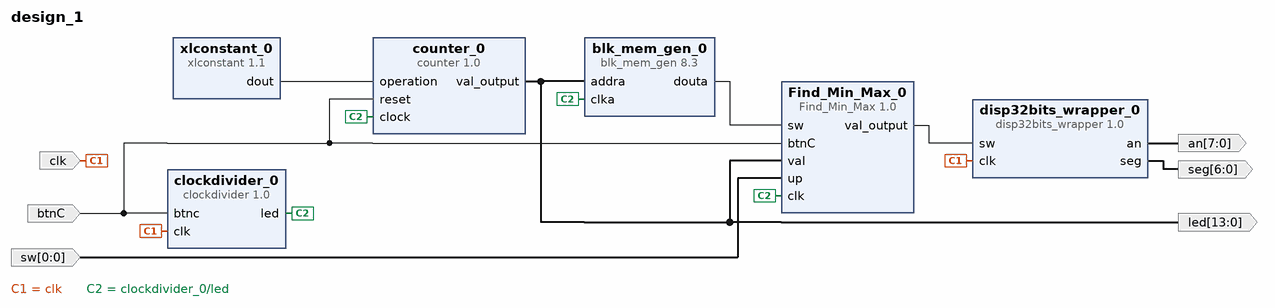
[diagram p0: block diagram of the top level]
# Vivado block design design_1, xc7a100tcsg324-1, Vivado 2016.4
create_bd_design design_1

create_bd_port -dir I btnC
create_bd_port -dir O -from 13 -to 0 led
create_bd_port -dir I -from 0 -to 0 sw
create_bd_port -dir I clk
create_bd_port -dir O -from 7 -to 0 an
create_bd_port -dir O -from 6 -to 0 seg

create_bd_cell -type ip -vlnv xilinx.com:ip:xlconstant:1.1 xlconstant_0
create_bd_cell -type ip -vlnv xilinx.com:ip:blk_mem_gen:8.3 blk_mem_gen_0
set_property -dict [list \
  CONFIG.Memory_Type Single_Port_ROM \
  CONFIG.Enable_32bit_Address false \
  CONFIG.Enable_A Always_Enabled \
  CONFIG.Register_PortA_Output_of_Memory_Primitives false \
  CONFIG.Load_Init_File true \
  CONFIG.Coe_File ../../../../../../../../../../../../../../users/joao/desktop/cr/git/reconfigurable_computing/lesson4/mul.coe \
  CONFIG.Use_RSTA_Pin false \
  CONFIG.Port_A_Write_Rate 0 \
  CONFIG.use_bram_block Stand_Alone \
] [get_bd_cells blk_mem_gen_0]
create_bd_cell -type ip -vlnv xilinx.com:user:counter:1.0 counter_0
set_property -dict {CONFIG.size 14} [get_bd_cells counter_0]
create_bd_cell -type ip -vlnv xilinx.com:user:clockdivider:1.0 clockdivider_0
create_bd_cell -type ip -vlnv xilinx.com:user:disp32bits_wrapper:1.0 disp32bits_wrapper_0
create_bd_cell -type ip -vlnv xilinx.com:user:Find_Min_Max:1.0 Find_Min_Max_0

# ---- connections ----

connect_bd_net [get_bd_pins xlconstant_0/dout] [get_bd_pins counter_0/operation]
connect_bd_net [get_bd_ports btnC] [get_bd_pins counter_0/reset] [get_bd_pins clockdivider_0/btnc] [get_bd_pins Find_Min_Max_0/btnC]
connect_bd_net -net counter_0_output [get_bd_pins counter_0/val_output] \
  [get_bd_ports led] [get_bd_pins blk_mem_gen_0/addra] [get_bd_pins Find_Min_Max_0/val]
connect_bd_net [get_bd_pins blk_mem_gen_0/douta] [get_bd_pins Find_Min_Max_0/sw]
connect_bd_net [get_bd_ports sw] [get_bd_pins Find_Min_Max_0/up]
connect_bd_net -net Find_Min_Max_0_output [get_bd_pins Find_Min_Max_0/val_output] [get_bd_pins disp32bits_wrapper_0/sw]
connect_bd_net [get_bd_ports clk] [get_bd_pins clockdivider_0/clk] [get_bd_pins disp32bits_wrapper_0/clk]
connect_bd_net [get_bd_pins clockdivider_0/led] [get_bd_pins counter_0/clock] [get_bd_pins blk_mem_gen_0/clka] [get_bd_pins Find_Min_Max_0/clk]
connect_bd_net [get_bd_pins disp32bits_wrapper_0/an] [get_bd_ports an]
connect_bd_net [get_bd_pins disp32bits_wrapper_0/seg] [get_bd_ports seg]

validate_bd_design
save_bd_design
